# EAGLE design placa2caras_CTO4 (EAGLE 7.6.0)
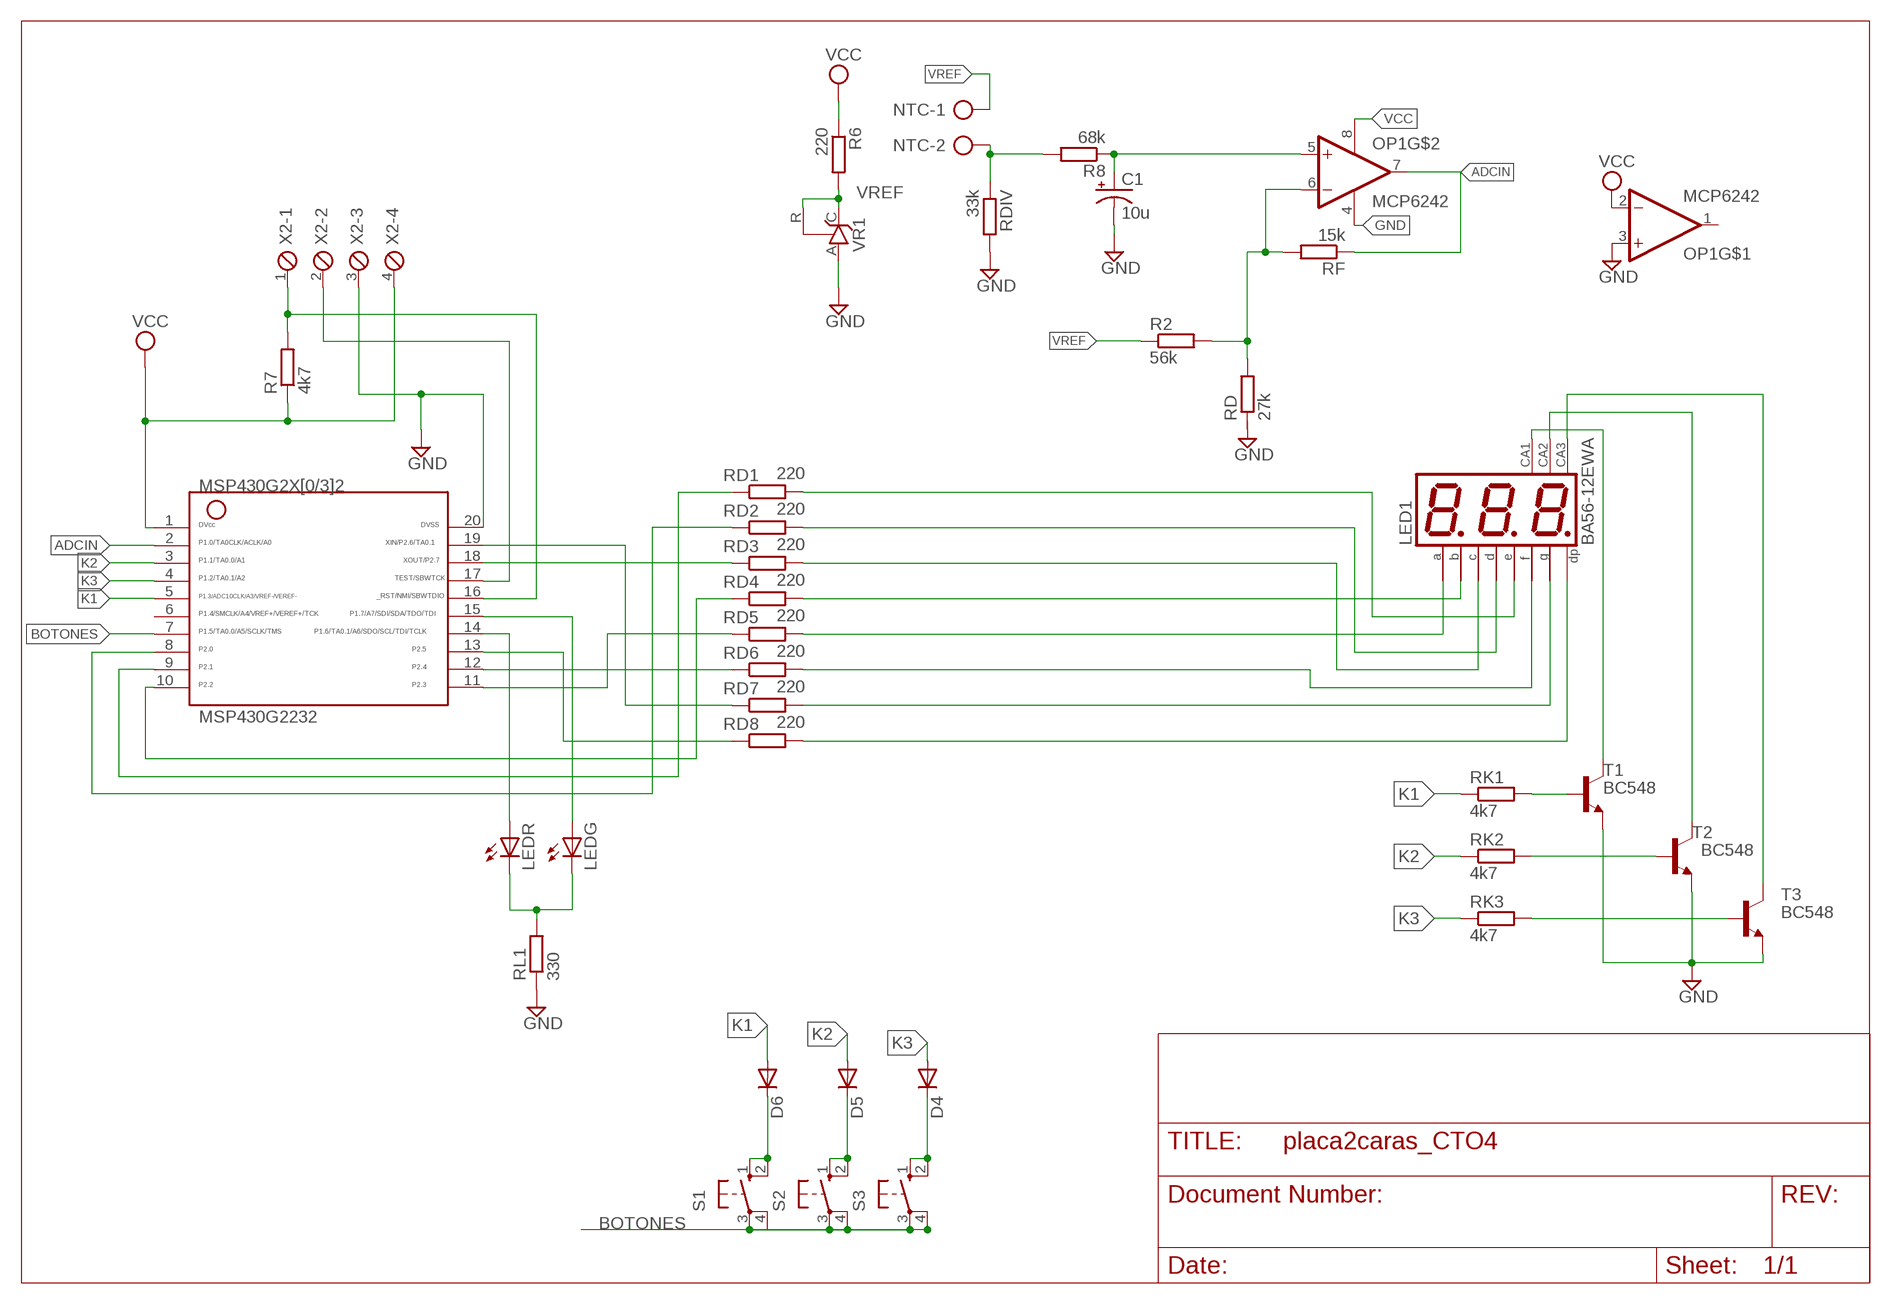
[diagram p0: schematic, sheet 1]

## Parts
C1  10u  CPOL-USE2,5-6E  [E2,5-6E]
D4  1N4148DO35-10  [DO35-10]
D5  1N4148DO35-10  [DO35-10]
D6  1N4148DO35-10  [DO35-10]
LED1  BA56-12EWA  [BX56-12]
LEDG  LED5MM  [LED5MM]
LEDR  LED5MM  [LED5MM]
MSP430G2232  G2X[0/3]2---N20  [N20]
NTC  AK500/2  [AK500/2]
OP1  MCP6242  MCP6242CONPADGORDO  [DIL8_MOD]
R2  56k  R-EU_0207/10  [0207/10]
R6  220  R-EU_0207/10  [0207/10]
R7  4k7  R-EU_0207/10  [0207/10]
R8  68k  R-EU_0207/10  [0207/10]
RD  27k  R-EU_0207/10  [0207/10]
RD1  220  R-EU_0207/10  [0207/10]
RD2  220  R-EU_0207/10  [0207/10]
RD3  220  R-EU_0207/10  [0207/10]
RD4  220  R-EU_0207/10  [0207/10]
RD5  220  R-EU_0207/10  [0207/10]
RD6  220  R-EU_0207/10  [0207/10]
RD7  220  R-EU_0207/10  [0207/10]
RD8  220  R-EU_0207/10  [0207/10]
RDIV  33k  R-EU_0207/10  [0207/10]
RF  15k  R-EU_0207/10  [0207/10]
RK1  4k7  R-EU_0207/10  [0207/10]
RK2  4k7  R-EU_0207/10  [0207/10]
RK3  4k7  R-EU_0207/10  [0207/10]
RL1  330  R-EU_0207/10  [0207/10]
S1  10-XX  [B3F-10XX]
S2  10-XX  [B3F-10XX]
S3  10-XX  [B3F-10XX]
T1  BC548  [TO92-EBC]
T2  BC548  [TO92-EBC]
T3  BC548  [TO92-EBC]
VR1  TL431CLP  [TO92-CLP]
X2  MPT4  [4POL254]

## Nets
ADCIN: MSP430G2232.2 OP1.7(OUT) RF.1
BOTONES: MSP430G2232.7 S1.3(P) S1.4(P1) S2.3(P) S2.4(P1) S3.3(P) S3.4(P1)
GND: C1.- MSP430G2232.20 OP1.3(+IN) OP1.4(V-) RD.1 RDIV.2 RL1.1 T1.E T2.E T3.E VR1.A X2.3
K1: D6.A MSP430G2232.5 RK1.1
K2: D5.A MSP430G2232.3 RK2.1
K3: D4.A MSP430G2232.4 RK3.1
N$1: RK1.2 T1.B
N$2: RK2.2 T2.B
N$3: RK3.2 T3.B
N$4: LED1.11(A) RD5.2
N$5: LED1.1(E) RD1.2
N$6: LED1.2(D) RD2.2
N$7: LED1.4(C) RD3.2
N$8: LED1.7(B) RD4.2
N$9: LED1.10(F) RD6.2
N$10: LED1.5(G) RD7.2
N$11: MSP430G2232.17 X2.2
N$12: LED1.3(DP) RD8.2
N$13: OP1.6(-IN) R2.2 RD.2 RF.2
N$14: LED1.12(CA) T1.C
N$15: NTC.2 R8.2 RDIV.1
N$16: LED1.9(CA) T2.C
N$17: C1.+ OP1.5(+IN) R8.1
N$18: LED1.8(CA) T3.C
N$19: LEDG.K(C) LEDR.K(C) RL1.2
N$20: MSP430G2232.16 R7.2 X2.1
N$21: MSP430G2232.19 RD7.1
N$22: MSP430G2232.18 RD3.1
N$23: MSP430G2232.13 RD8.1
N$24: MSP430G2232.12 RD6.1
N$25: MSP430G2232.11 RD5.1
N$26: MSP430G2232.10 RD4.1
N$27: MSP430G2232.9 RD1.1
N$28: MSP430G2232.8 RD2.1
N$29: D5.C S2.1(S) S2.2(S1)
N$30: D4.C S3.1(S) S3.2(S1)
N$31: D6.C S1.1(S) S1.2(S1)
N$32: LEDG.A MSP430G2232.15
N$34: LEDR.A MSP430G2232.14
VCC: MSP430G2232.1 OP1.2(-IN) OP1.8(V+) R6.1 R7.1 X2.4
VREF: NTC.1 R2.1 R6.2 VR1.C VR1.R
Unconnected: MSP430G2232.6 OP1.1(OUT)

## Library data of the parts
C1 = rcl:CPOL-US: POLARIZED CAPACITOR, American symbol
D4-D6 = diode:1N4148: DIODE high speed (Philips)
LED1 = display-kingbright:B?56-12*WA: 14.22mm (0.56INCH) THREE DIGIT NUMERIC DISPLAY Source: http://www.kingbright.com .. BA56-11EWA(Ver1189474895.pdf; OC_FARNELL: unknown; OC_NEWARK: unknown
LEDG LEDR = led:LED: LED OSRAM: - CHIPLED LG R971, LG N971, LY N971, LG Q971, LY Q971, LO R971, LY R971 LH N974, LH R974 LS Q976, LO Q976, LY Q976 LO Q996 - Hyper CHIPLED LW Q18S LB Q993, LB Q99A, LB R99A - SideLED LS A670, LO A670, LY A670, LG A670, LP A670 LB A673, LV A673, LT A673, LW A673 LH A674 LY A675 LS A676, LA A676, LO A676, LY A676, LW A676 LS A679, LY A679, LG A679 - Hyper Micro SIDELED® LS Y876, LA Y876, LO Y876, LY Y876 LT Y87S - SmartLED LW L88C, LW L88S LB L89C, LB L89S, LG L890 LS L89K, LO L89K, LY L89K LS L896, LA L896, LO L896, LY L896 - TOPLED LS T670, LO T670, LY T670, LG T670, LP T670 LSG T670, LSP T670, LSY T670, LOP T670, LYG T670 LG T671, LOG T671, LSG T671 LB T673, LV T673, LT T673, LW T673 LH T674 LS T676, LA T676, LO T676, LY T676, LB T676, LH T676, LSB T676, LW T676 LB T67C, LV T67C, LT T67C, LS T67K, LO T67K, LY T67K, LW E67C LS E67B, LA E67B, LO E67B, LY E67B, LB E67C, LV E67C, LT E67C LW T67C LS T679, LY T679, LG T679 LS T770, LO T770, LY T770, LG T770, LP T770 LB T773, LV T773, LT T773, LW T773 LH T774 LS E675, LA E675, LY E675, LS T675 LS T776, LA T776, LO T776, LY T776, LB T776 LHGB T686 LT T68C, LB T68C - Hyper Mini TOPLED® LB M676 - Mini TOPLED Santana® LG M470 LS M47K, LO M47K, LY M47K Source: http://www.osram.convergy.de LUXEON: - LUMILED® LXK2-PW12-R00, LXK2-PW12-S00, LXK2-PW14-U00, LXK2-PW14-V00 LXK2-PM12-R00, LXK2-PM12-S00, LXK2-PM14-U00 LXK2-PE12-Q00, LXK2-PE12-R00, LXK2-PE12-S00, LXK2-PE14-T00, LXK2-PE14-U00 LXK2-PB12-K00, LXK2-PB12-L00, LXK2-PB12-M00, LXK2-PB14-N00, LXK2-PB14-P00, LXK2-PB14-Q00 LXK2-PR12-L00, LXK2-PR12-M00, LXK2-PR14-Q00, LXK2-PR14-R00 LXK2-PD12-Q00, LXK2-PD12-R00, LXK2-PD12-S00 LXK2-PH12-R00, LXK2-PH12-S00 LXK2-PL12-P00, LXK2-PL12-Q00, LXK2-PL12-R00 Source: www.luxeon.com KINGBRIGHT: KA-3528ASYC Source: www.kingbright.com
MSP430G2232 = TI_MSP430_v16:G2X[0/3]2---N20: MSP430G2X[0/3]2 MSP430G2x32, MSP430G2x02 PDIP (N) 20 Pin Package http://focus.ti.com/docs/prod/folders/print/msp430g2432.html
NTC = con-ptr500:AK500/2: CONNECTOR; OC_FARNELL: unknown; OC_NEWARK: unknown
OP1 = linear:MCP6242: Opamp de Microchip. Rail to rail, 3V
R2 R6-R8 RD RD1-RD8 RDIV RF RK1-RK3 = resistor_mod2:R-EU_: RESISTOR, European symbol
RL1 = resistor_mod:R-EU_: RESISTOR, European symbol
S1-S3 = switch-omron:10-XX: OMRON SWITCH; MPN: B3F-1000; OC_FARNELL: 176432; OC_NEWARK: 36M3542
T1-T3 = transistor-npn:BC548*: NPN Transistor
VR1 = v-reg:TL431CLP: VOLTAGE REGULATOR
X2 = con-phoenix-254:MPT4: PHOENIX CONNECTOR; OC_FARNELL: unknown; OC_NEWARK: unknown

## Board
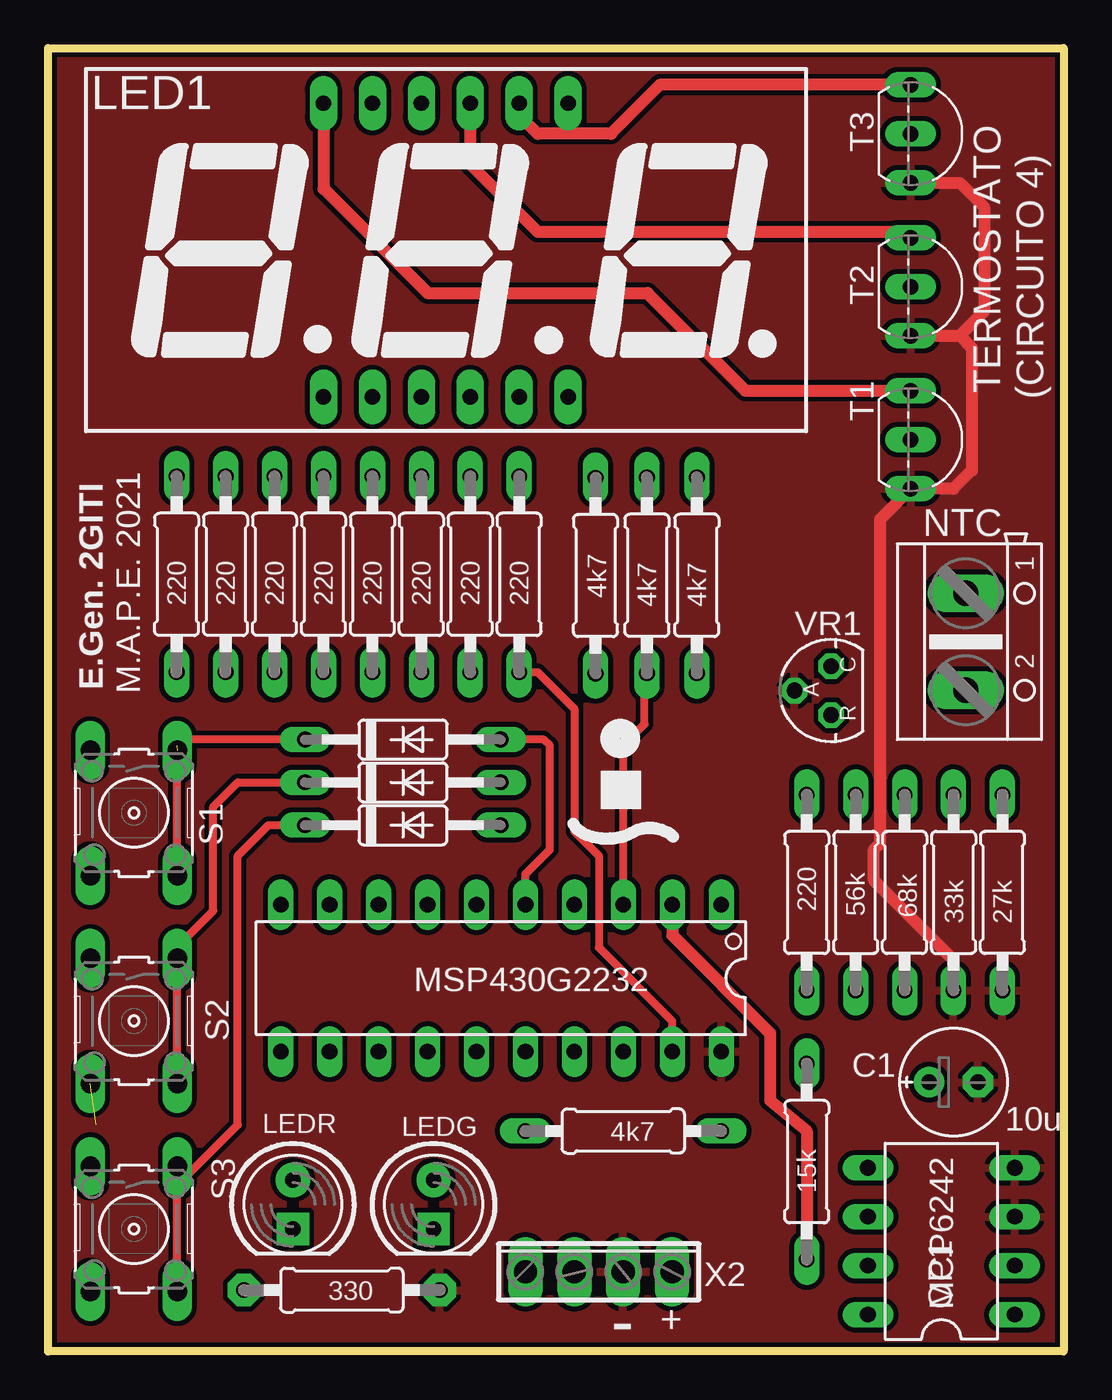
[diagram p1: board, top side]
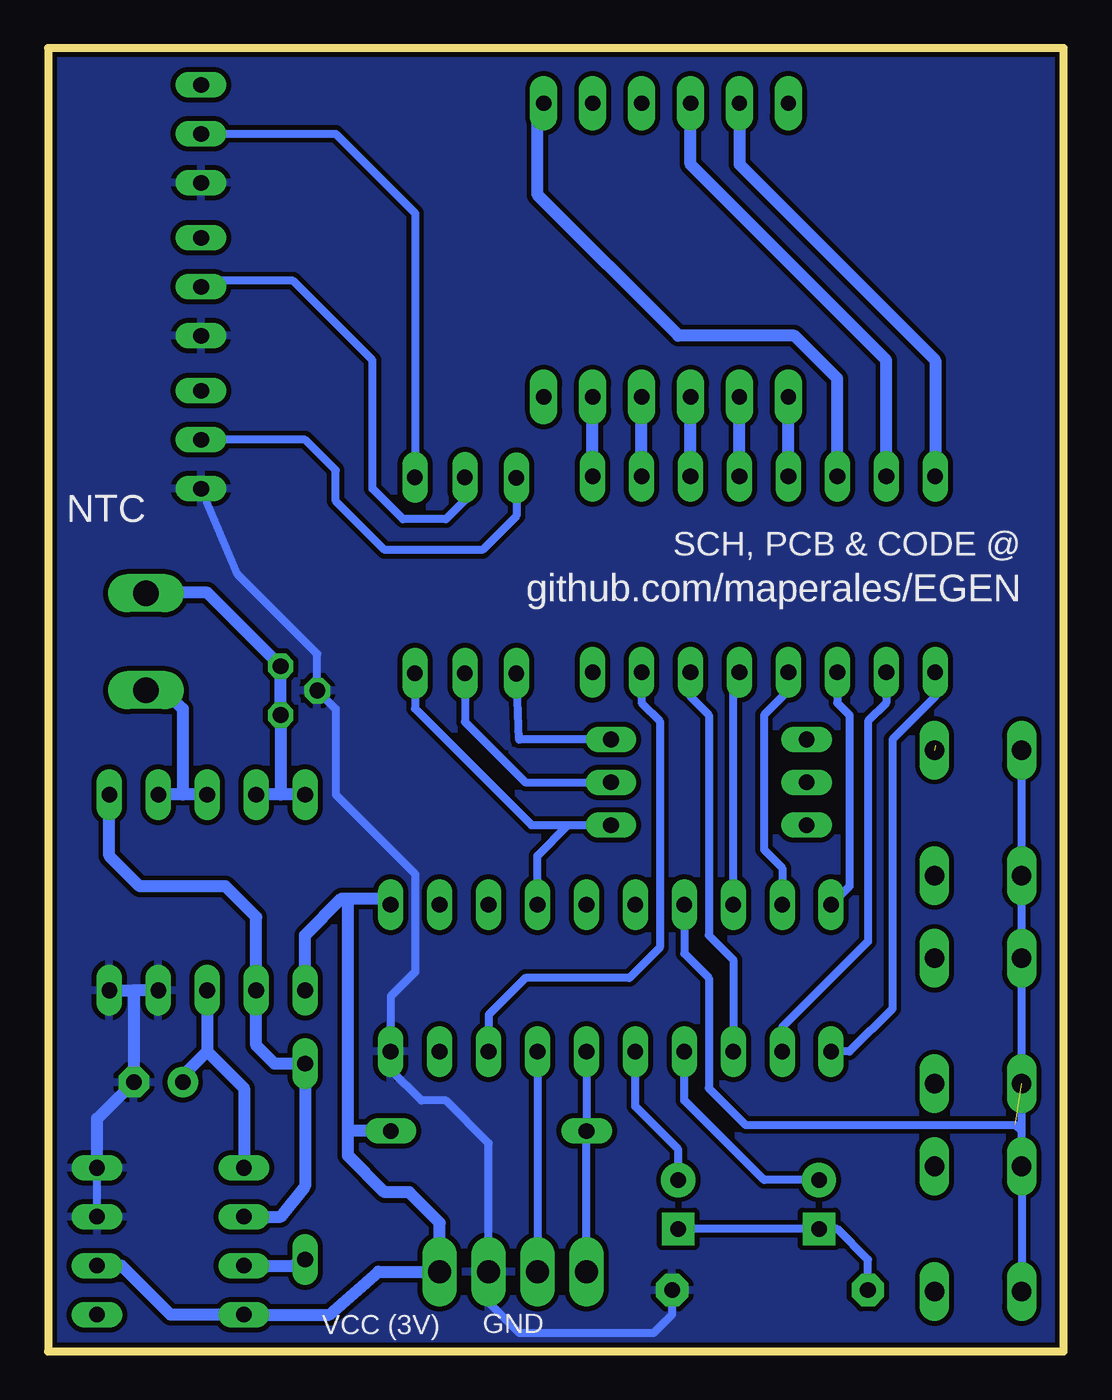
[diagram p2: board, bottom side, seen from below]

Size 52.7 x 67.63 mm. Coordinates in mm from the lower left corner, seen from the top.
Outline: 0,67.63 52.7,67.63 52.7,0 0,0 0,67.63
Copper layers (1*16): Top 0.035mm / dielectric 1.5mm / Bottom 0.035mm
Design rules "SeeedStudio_2layer_DRU_no_angle_20140221": minimum track width 6mil, minimum drill 12mil, track to track 6mil, track to pad 6mil, pad to pad 6mil, via to via 6mil, smd to smd 0mil, copper to edge 10mil, drill to drill 10mil, minimum pad ring 10mil, minimum via ring 6mil, stop-mask expansion 2mil, vias tented up to drill 100mil, thermal gap 10mil

### Footprints (pad centres in the part's own frame; a part is rotated, then mirrored left to right if it is on the bottom)
E2,5-6E = drill 0.813 pad 1.575: + -1.27,0 | drill 0.813 pad 1.575 octagon: - 1.27,0
DO35-10 = drill 0.813 long: A 5.08,0; C -5.08,0
BX56-12 = drill 0.8 pad 1.422 long: 1 -6.35,-7.62; 2 -3.81,-7.62; 3 -1.27,-7.62; 4 1.27,-7.62; 5 3.81,-7.62; 6 6.35,-7.62; 7 6.35,7.62; 8 3.81,7.62; 9 1.27,7.62; 10 -1.27,7.62; 11 -3.81,7.62; 12 -6.35,7.62
LED5MM = drill 0.8 pad 1.778: A -1.27,0 | drill 0.8 pad 1.676 square: K 1.27,0
N20 = drill 0.813 long: 1 -11.435,-3.81; 2 -8.895,-3.81; 3 -6.355,-3.81; 4 -3.815,-3.81; 5 -1.275,-3.81; 6 1.265,-3.81; 7 3.805,-3.81; 8 6.345,-3.81; 9 8.885,-3.81; 10 11.425,-3.81; 11 11.425,3.81; 12 8.885,3.81; 13 6.345,3.81; 14 3.805,3.81; 15 1.265,3.81; 16 -1.275,3.81; 17 -3.815,3.81; 18 -6.355,3.81; 19 -8.895,3.81; 20 -11.435,3.81
AK500/2 = drill 1.321 long: 1 -2.515,0; 2 2.515,0
DIL8_MOD = drill 0.813 pad 1.27 long: 1 -6.35,-3.81; 2 -3.81,-3.81; 3 -1.27,-3.81; 4 1.27,-3.81; 5 1.27,3.81; 6 -1.27,3.81; 7 -3.81,3.81; 8 -6.35,3.81
0207/10 = drill 0.813 long: 1 -5.08,0; 2 5.08,0
0207/10' = drill 0.813 pad 1.676 octagon: 1 -5.08,0; 2 5.08,0
B3F-10XX = drill 1.016 long: 1 -3.251,2.261; 2 3.251,2.261; 3 -3.251,-2.261; 4 3.251,-2.261
TO92-EBC = drill 0.813 long: B 0,-1.27; C -2.54,-1.27; E 2.54,-1.27
TO92-CLP = drill 0.813 octagon: A 0,1.905; C 1.27,0; R -1.27,0
4POL254 = drill 1.2 long: 1 -3.81,0; 2 -1.27,0; 3 1.27,0; 4 3.81,0

### Placement (x,y rotation side)
C1  46.99,13.97 0 top
D4  18.41,27.31 0 top
D5  18.41,29.53 0 top
D6  18.41,31.75 0 top
LED1  20.64,57.15 0 top
LEDG  20,7.62 270 top
LEDR  12.7,7.62 270 top
MSP430G2232  23.49,19.37 180 top
NTC  47.62,36.83 270 top
OP1  46.36,8.25 90 top
R2  41.91,23.81 270 top
R6  39.37,23.81 90 top
R7  29.84,11.43 180 top
R8  44.45,23.81 90 top
RD  49.53,23.81 90 top
RD1  14.29,40.32 90 top
RD2  16.83,40.32 90 top
RD3  21.91,40.32 90 top
RD4  11.75,40.32 90 top
RD5  6.67,40.32 90 top
RD6  9.21,40.32 90 top
RD7  24.45,40.32 90 top
RD8  19.37,40.32 90 top
RDIV  46.99,23.81 270 top
RF  39.37,9.84 90 top
RK1  28.41,40.26 90 top
RK2  31.08,40.27 90 top
RK3  33.67,40.27 90 top
RL1  330  [0207/10']  15.24,3.17 180 top
S1  4.45,27.94 270 top
S2  4.45,17.14 270 top
S3  4.45,6.35 270 top
T1  46.04,47.31 270 top
T2  46.04,55.24 270 top
T3  46.04,63.18 270 top
VR1  40.64,34.29 90 top
X2  28.58,4.13 0 top

### Tracks (layer width: path | path; a pad name or v marks a point on that pad's centre or on a via)
ADCIN
  Top 0.61: MSP430G2232.2 32.39,21.59 37.47,16.51 37.47,13.02 39.37,11.43 RF.1
  Bottom 0.61: OP1.7 40.01,4.44 RF.1
BOTONES  (1 unrouted)
  Bottom 0.406: S3.4 S3.3 2.18,11.43 | 2.18,11.43 S2.3 S1.4 S1.3 | MSP430G2232.7 19.69,20.64 18.41,19.37 18.41,13.65 16.51,11.75 2.5,11.75 2.18,11.43
GND
  Top 0.61: T3.E 47.31,60.64 48.58,59.37 48.58,53.97 47.31,52.71 | T2.E 47.31,52.71 | 47.31,52.71 47.94,52.07 47.94,45.72 46.99,44.77 T1.E 43.18,43.18 43.18,26.35 42.86,26.03 42.86,24.45 46.99,20.32 RDIV.2
  Bottom 0.406: OP1.3 OP1.4 | T1.E 42.86,40.32 38.73,36.2 VR1.A 37.78,33.34 37.78,28.89 33.66,24.76 33.66,19.69 34.93,18.42 MSP430G2232.20 34.93,15.25 34.93,14.6 33.34,13.02 32.07,13.02 29.84,10.79 X2.3 29.84,2.54 28.26,0.95 21.27,0.95 20.32,1.91 RL1.1 | T3.E 45.09,60.64
  Bottom 0.61: OP1.4 50.16,12.07 C1.- 48.26,18.73 | RDIV.2 48.26,18.73 | RD.1 48.26,18.73
  pour Top (isolate 0.254): -0.32,68.9 54.29,68.26 54.29,-2.22 -0.63,-1.91
  pour Bottom (isolate 0.254): -0.32,68.9 53.98,68.26 54.29,-1.59 -0.79,-1.59
K1
  Top 0.406: MSP430G2232.5 24.77,24.77 26.03,26.03 26.03,31.43 25.72,31.75 D6.A
  Bottom 0.406: D6.A 28.26,31.75 RK1.1
K2
  Top 0.406: MSP430G2232.3 29.85,31.44 30.96,32.54 30.96,35.07 RK2.1
  Bottom 0.406: RK2.1 31.08,32.66 27.94,29.53 D5.A
K3
  Bottom 0.406: RK3.1 33.67,33.35 27.62,27.31 25.72,27.31 | 25.72,27.31 D4.A | MSP430G2232.4 27.31,25.71 25.72,27.31
N$1
  Bottom 0.406: RK1.2 28.41,43.35 30.16,41.59 35.24,41.59 37.78,44.13 37.78,45.72 39.37,47.31 T1.B
N$2
  Bottom 0.406: RK2.2 31.08,44.17 32.07,43.18 34.29,43.18 35.88,44.77 35.88,51.43 40.01,55.56 44.45,55.56 T2.B
N$3
  Bottom 0.406: T3.B 37.78,63.18 33.66,59.06 RK3.2
N$4
  Bottom 0.61: LED1.11 16.83,61.6 6.67,51.43 RD5.2
N$5
  Bottom 0.61: RD1.2 LED1.1
N$6
  Bottom 0.61: RD2.2 LED1.2
N$7
  Bottom 0.61: RD3.2 LED1.4
N$8
  Bottom 0.61: RD4.2 11.75,50.48 13.97,52.71 20,52.71 27.3,60.01 27.3,64.45 LED1.7
N$9
  Bottom 0.61: RD6.2 9.21,51.43 19.37,61.6 LED1.10
N$10
  Bottom 0.61: RD7.2 LED1.5
N$11
  Bottom 0.406: MSP430G2232.17 X2.2
N$12
  Bottom 0.61: RD8.2 LED1.3
N$13
  Bottom 0.61: OP1.6 40.64,6.99 39.37,8.57 RF.2 40.96,14.92 41.91,15.87 R2.2 41.91,22.54 43.5,24.13 47.94,24.13 49.53,25.72 RD.2
N$14
  Top 0.61: LED1.12 14.29,60.33 19.69,54.93 31.12,54.93 36.2,49.85 T1.C
N$15
  Bottom 0.61: R8.2 45.72,28.89 | 45.72,28.89 RDIV.1 | NTC.2 46.7,34.32 45.72,33.34 45.72,28.89
N$16
  Top 0.61: LED1.9 21.91,61.6 25.4,58.1 44.45,58.1 T2.C
N$17
  Bottom 0.61: R8.1 44.45,15.56 | 44.45,15.56 42.55,13.65 OP1.5 | C1.+ 45.72,14.29 44.45,15.56
N$18
  Top 0.61: T3.C 31.75,65.72 29.21,63.18 25.4,63.18 24.77,63.82 24.77,64.45 LED1.8
N$19
  Bottom 0.406: LEDG.K LEDR.K 11.75,6.35 10.16,4.76 RL1.2
N$20
  Bottom 0.406: X2.1 R7.2 24.77,11.75 MSP430G2232.16
N$21
  Top 0.406: RD7.1 25.4,35.24 27.3,33.34 27.3,26.99 28.58,25.72 28.58,20.96 32.39,17.14 MSP430G2232.19
N$22
  Bottom 0.406: RD3.1 21.91,33.65 20.95,32.7 20.95,20.96 22.54,19.37 27.94,19.37 29.84,17.46 MSP430G2232.18
N$23
  Bottom 0.406: RD8.1 19.37,33.97 18.41,33.02 18.41,21.59 17.15,20.32 MSP430G2232.13
N$24
  Bottom 0.406: RD6.1 9.21,33.65 10.16,32.7 10.16,21.27 14.6,16.83 MSP430G2232.12
N$25
  Bottom 0.406: RD5.1 6.67,33.97 8.89,31.75 8.89,17.78 11.11,15.56 MSP430G2232.11
N$26
  Bottom 0.406: RD4.1 11.75,33.65 11.11,33.02 11.11,24.14 MSP430G2232.10
N$27
  Bottom 0.406: RD1.1 14.29,34.29 15.56,33.02 15.56,26.03 14.6,25.08 MSP430G2232.9
N$28
  Bottom 0.406: MSP430G2232.8 17.15,34.92 RD2.1
N$29
  Top 0.406: S2.2 S2.1 6.71,20.99 8.57,22.86 8.57,28.26 9.84,29.53 D5.C
N$30
  Top 0.406: S3.2 S3.1 6.71,8.61 9.84,11.75 9.84,25.72 11.43,27.31 D4.C
N$31  (1 unrouted)
  Top 0.406: D6.C 6.98,31.75 6.67,31.43 6.67,25.29 S1.2
N$32
  Bottom 0.406: LEDG.A 20,10.48 22.23,12.7 MSP430G2232.15
N$34
  Bottom 0.406: LEDR.A 15.56,8.89 19.69,13.02 MSP430G2232.14
VCC
  Bottom 0.61: OP1.2 48.9,4.44 46.36,1.91 OP1.8 38.1,1.91 35.56,4.13 X2.4 32.39,6.67 33.97,8.26 35.24,8.26 37.15,10.16 37.15,11.43 | R6.1 39.37,21.59 37.47,23.5 37.15,23.5 | 37.15,23.5 35.25,23.5 MSP430G2232.1 | 37.15,11.43 37.15,23.5 | R7.1 37.15,11.43
VREF
  Bottom 0.406: VR1.C 40.64,35.88 40.96,35.88
  Bottom 0.61: VR1.C VR1.R 40.64,28.89 | 40.96,35.88 44.45,39.37 46.97,39.37 NTC.1 | R6.2 40.64,28.89 | 40.64,28.89 R2.1

### Text on the board
tPlace: TERMOSTATO | (CIRCUITO 4) | E.Gen. 2GITI | M.A.P.E. 2021 | + | -
bPlace: NTC | SCH, PCB & CODE @ | github.com/maperales/EGEN | VCC (3V) | GND